# Altium project Mixer_4+4LineIn.PrjPcb
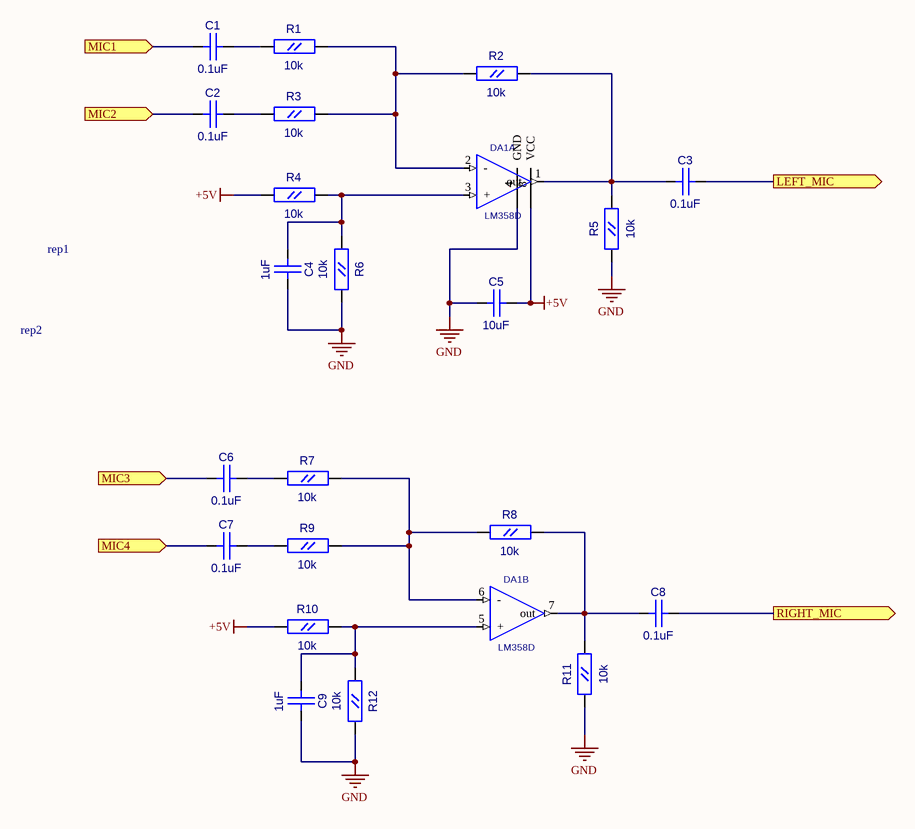
[diagram p0: Main.SchDoc]
4 sheets, 77 parts. Net scope: flat (ports and power ports of the same name join across sheets).
Board file: Mixer_6mic_1lin.PcbDoc
Sheets:
  Main.SchDoc
  Main_line_in.SchDoc
  Connection.SchDoc
  Power.SchDoc

## Sheet Main.SchDoc
size A4

### Parts
C1  0.1uF  [CC0603]
C2  0.1uF  [CC0603]
C3  0.1uF  [CC0603]
C4  1uF  [CC0603]
C5  10uF  [CC0805]
C6  0.1uF  [CC0603]
C7  0.1uF  [CC0603]
C8  0.1uF  [CC0603]
C9  1uF  [CC0603]
DA1  LM358D  [SO-8]  (parts A,B of 2)
R1  10k  [RC0603]
R2  10k  [RC0603]
R3  10k  [RC0603]
R4  10k  [RC0603]
R5  10k  [RC0603]
R6  10k  [RC0603]
R7  10k  [RC0603]
R8  10k  [RC0603]
R9  10k  [RC0603]
R10  10k  [RC0603]
R11  10k  [RC0603]
R12  10k  [RC0603]
rep1  REPER1.2  [REPER1.2]  (value not drawn)
rep2  REPER1.2  [REPER1.2]  (value not drawn)

### Ports
LEFT_MIC (out), MIC1 (in), MIC2 (in), MIC3 (in), MIC4 (in), RIGHT_MIC (out)

### Nets
+5V: C5.2(B) DA1.8(VCC) R4.1(A) R10.1(A)
GND: C4.2(B) C5.1(A) C9.2(B) DA1.4(GND) R5.1(A) R6.2(B) R11.1(A) R12.2(B)
NetC1_1: C1.1(A) ; port MIC1
NetC1_2: C1.2(B) R1.1(A)
NetC2_1: C2.1(A) ; port MIC2
NetC2_2: C2.2(B) R3.1(A)
NetC3_1: C3.1(A) DA1.1(out) R2.2(B) R5.2(B)
NetC3_2: C3.2(B) ; port LEFT_MIC
NetC4_1: C4.1(A) DA1.3(+) R4.2(B) R6.1(A)
NetC6_1: C6.1(A) ; port MIC3
NetC6_2: C6.2(B) R7.1(A)
NetC7_1: C7.1(A) ; port MIC4
NetC7_2: C7.2(B) R9.1(A)
NetC8_1: C8.1(A) DA1.7(out) R8.2(B) R11.2(B)
NetC8_2: C8.2(B) ; port RIGHT_MIC
NetC9_1: C9.1(A) DA1.5(+) R10.2(B) R12.1(A)
NetDA1_2: DA1.2(-) R1.2(B) R2.1(A) R3.2(B)
NetDA1_6: DA1.6(-) R7.2(B) R8.1(A) R9.2(B)

Not connected (* = marked no-connect by the designer): rep1 1; rep2 1

### Library data of the parts
C1-C4 C6-C9 = CC0603
  C1-C3 C6-C8: Value: 0.1uF
  C4 C9: Value: 1uF
C5 = CC0805: Value: 10uF
R1-R12 = RC0603: Value: 10k
DA1 = LM358D: Value: *
rep1 rep2 = REPER1.2: Value: *

## Sheet Main_line_in.SchDoc
size A4
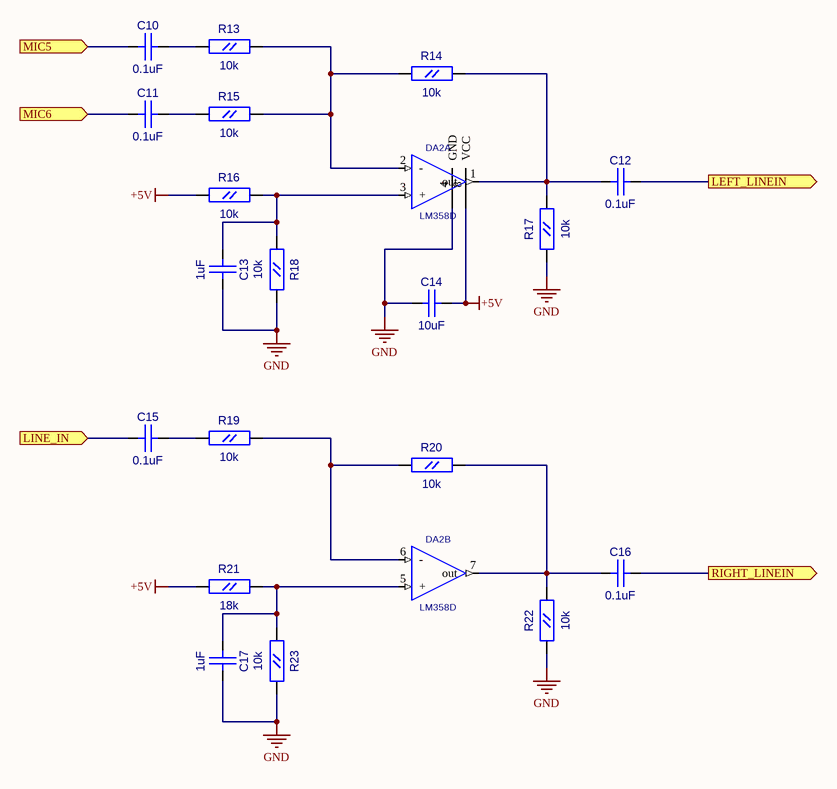
[diagram p1: Main_line_in.SchDoc]

### Parts
C10  0.1uF  [CC0603]
C11  0.1uF  [CC0603]
C12  0.1uF  [CC0603]
C13  1uF  [CC0603]
C14  10uF  [CC0805]
C15  0.1uF  [CC0603]
C16  0.1uF  [CC0603]
C17  1uF  [CC0603]
DA2  LM358D  [SO-8]  (parts A,B of 2)
R13  10k  [RC0603]
R14  10k  [RC0603]
R15  10k  [RC0603]
R16  10k  [RC0603]
R17  10k  [RC0603]
R18  10k  [RC0603]
R19  10k  [RC0603]
R20  10k  [RC0603]
R21  18k  [RC0603]
R22  10k  [RC0603]
R23  10k  [RC0603]

### Ports
LEFT_LINEIN (out), LINE_IN (in), MIC5 (in), MIC6 (in), RIGHT_LINEIN (out)

### Nets
+5V: C14.2(B) DA2.8(VCC) R16.1(A) R21.1(A)
GND: C13.2(B) C14.1(A) C17.2(B) DA2.4(GND) R17.1(A) R18.2(B) R22.1(A) R23.2(B)
NetC10_1: C10.1(A) ; port MIC5
NetC10_2: C10.2(B) R13.1(A)
NetC11_1: C11.1(A) ; port MIC6
NetC11_2: C11.2(B) R15.1(A)
NetC12_1: C12.1(A) DA2.1(out) R14.2(B) R17.2(B)
NetC12_2: C12.2(B) ; port LEFT_LINEIN
NetC13_1: C13.1(A) DA2.3(+) R16.2(B) R18.1(A)
NetC15_1: C15.1(A) ; port LINE_IN
NetC15_2: C15.2(B) R19.1(A)
NetC16_1: C16.1(A) DA2.7(out) R20.2(B) R22.2(B)
NetC16_2: C16.2(B) ; port RIGHT_LINEIN
NetC17_1: C17.1(A) DA2.5(+) R21.2(B) R23.1(A)
NetDA2_2: DA2.2(-) R13.2(B) R14.1(A) R15.2(B)
NetDA2_6: DA2.6(-) R19.2(B) R20.1(A)

### Library data of the parts
C10-C13 C15-C17 = CC0603
  C10-C12 C15 C16: Value: 0.1uF
  C13 C17: Value: 1uF
C14 = CC0805: Value: 10uF
R13-R23 = RC0603
  R13-R20 R22 R23: Value: 10k
  R21: Value: 18k
DA2 = LM358D: Value: *

## Sheet Connection.SchDoc
size A4
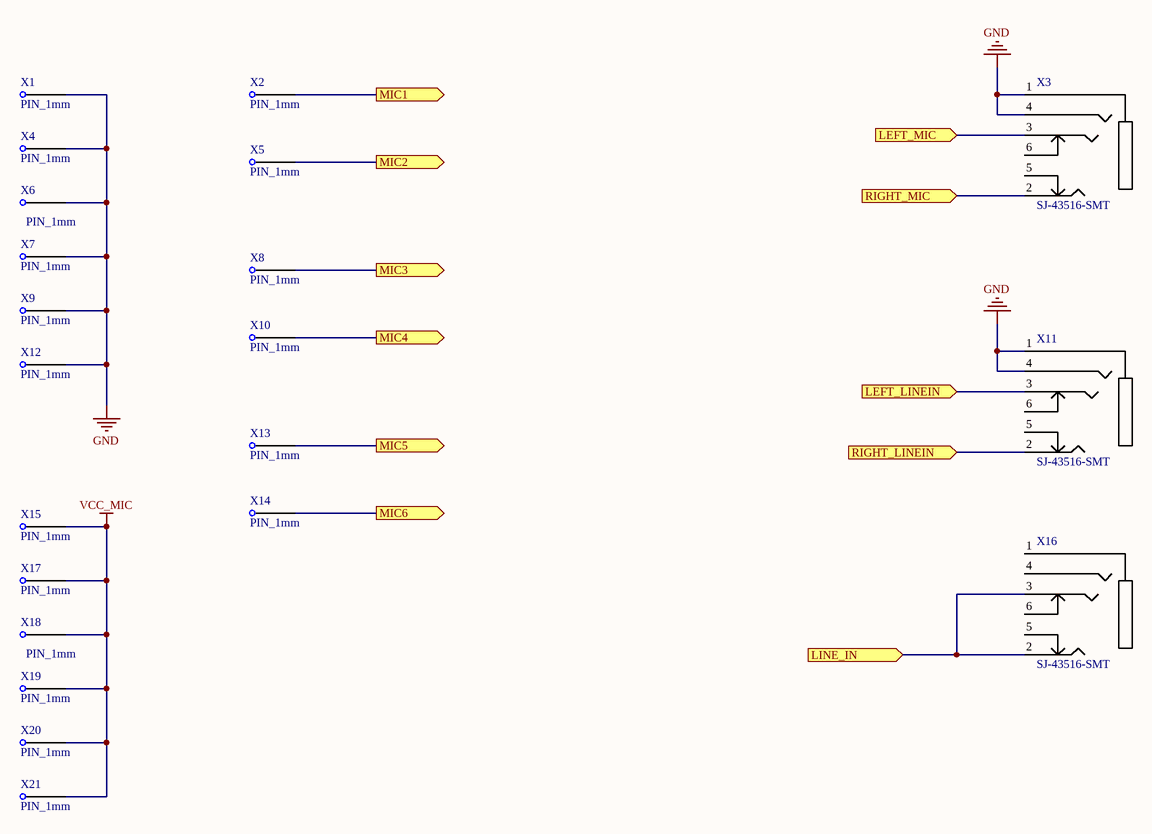
[diagram p2: Connection.SchDoc]

### Parts
X1  PIN_1mm  [PIN_1mm]
X2  PIN_1mm  [PIN_1mm]
X3  SJ-43516-SMT  [SJ-43516-SMT]
X4  PIN_1mm  [PIN_1mm]
X5  PIN_1mm  [PIN_1mm]
X6  PIN_1mm  [PIN_1mm]
X7  PIN_1mm  [PIN_1mm]
X8  PIN_1mm  [PIN_1mm]
X9  PIN_1mm  [PIN_1mm]
X10  PIN_1mm  [PIN_1mm]
X11  SJ-43516-SMT  [SJ-43516-SMT]
X12  PIN_1mm  [PIN_1mm]
X13  PIN_1mm  [PIN_1mm]
X14  PIN_1mm  [PIN_1mm]
X15  PIN_1mm  [PIN_1mm]
X16  SJ-43516-SMT  [SJ-43516-SMT]
X17  PIN_1mm  [PIN_1mm]
X18  PIN_1mm  [PIN_1mm]
X19  PIN_1mm  [PIN_1mm]
X20  PIN_1mm  [PIN_1mm]
X21  PIN_1mm  [PIN_1mm]

### Ports
LEFT_LINEIN (in), LEFT_MIC (in), LINE_IN (in), MIC1 (out), MIC2 (out), MIC3 (out), MIC4 (out), MIC5 (out), MIC6 (out), RIGHT_LINEIN (in), RIGHT_MIC (in)

### Nets
GND: X1.1 X3.1 X3.4 X4.1 X6.1 X7.1 X9.1 X11.1 X11.4 X12.1
VCC_MIC: X15.1 X17.1 X18.1 X19.1 X20.1 X21.1
NetC1_1: X2.1 ; port MIC1
NetC2_1: X5.1 ; port MIC2
NetC3_2: X3.3 ; port LEFT_MIC
NetC6_1: X8.1 ; port MIC3
NetC7_1: X10.1 ; port MIC4
NetC8_2: X3.2 ; port RIGHT_MIC
NetC10_1: X13.1 ; port MIC5
NetC11_1: X14.1 ; port MIC6
NetC12_2: X11.3 ; port LEFT_LINEIN
NetC15_1: X16.2 X16.3 ; port LINE_IN
NetC16_2: X11.2 ; port RIGHT_LINEIN

Not connected (* = marked no-connect by the designer): X3 5 6; X11 5 6; X16 1 4 5 6

### Library data of the parts
X3 X11 X16 = SJ-43516-SMT: 3.5mm connector 4 conductors

## Sheet Power.SchDoc
size A4
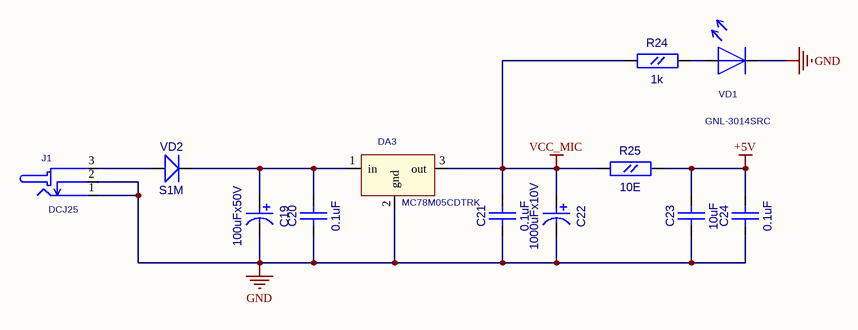
[diagram p3: Power.SchDoc]

### Parts
C19  100uFx50V  [CC8X3.5]
C20  0.1uF  [CC0603]
C21  0.1uF  [CC0603]
C22  1000uFx10V  [CC8X3.5]
C23  10uF  [CC0805]
C24  0.1uF  [CC0603]
DA3  MC78M05CDTRK  [D-PAK(TO-252AA)]
J1  DCJ25  [DCJ25]
R24  1k  [RC0603]
R25  10E  [RC0805]
VD1  GNL-3014SRC  [LED3]
VD2  S1M  [SMA]

### Nets
+5V: C23.2(B) C24.2(B) R25.2(B)
GND: C19.2 C20.1(A) C21.1(A) C22.2 C23.1(A) C24.1(A) DA3.2(gnd) J1.1 J1.2 VD1.1
VCC_MIC: C21.2(B) C22.1 DA3.3(out) R24.1(A) R25.1(A)
NetC19_1: C19.1 C20.2(B) DA3.1(in) VD2.2(K)
NetJ1_3: J1.3 VD2.1(A)
NetR24_2: R24.2(B) VD1.2

### Library data of the parts
C19 C22 = CAP0.35
  C19: Value: 100uFx50V
  C22: Value: 1000uFx10V
C20 C21 C24 = CC0603: Value: 0.1uF
C23 = CC0805: Value: 10uF
R24 = RC0603: Value: 1k
R25 = RC0805: Value: 10E
VD1 = LED_3: Value: GNL-3014SRC
VD2 = SS14: Schottky Rectifier; OriginalName: 10BQ100; ComponentField6: Published 8-Jun-2000, Modified 10-July-2000: SIM Model Added.; Value: S1M
DA3 = MC78M05CDTRK: Value: *
J1 = DCJ25: Value: *

## Nets that join several sheets
+5V: Main (C5.2 DA1.8 R4.1 R10.1), Main_line_in (C14.2 DA2.8 R16.1 R21.1), Power (C23.2 C24.2 R25.2)
GND: Main (8 pins), Main_line_in (8 pins), Connection (10 pins), Power (10 pins)
VCC_MIC: Connection (6 pins), Power (5 pins)
NetC1_1: Main (C1.1), Connection (X2.1)
NetC2_1: Main (C2.1), Connection (X5.1)
NetC3_2: Main (C3.2), Connection (X3.3)
NetC6_1: Main (C6.1), Connection (X8.1)
NetC7_1: Main (C7.1), Connection (X10.1)
NetC8_2: Main (C8.2), Connection (X3.2)
NetC10_1: Main_line_in (C10.1), Connection (X13.1)
NetC11_1: Main_line_in (C11.1), Connection (X14.1)
NetC12_2: Main_line_in (C12.2), Connection (X11.3)
NetC15_1: Main_line_in (C15.1), Connection (X16.2 X16.3)
NetC16_2: Main_line_in (C16.2), Connection (X11.2)